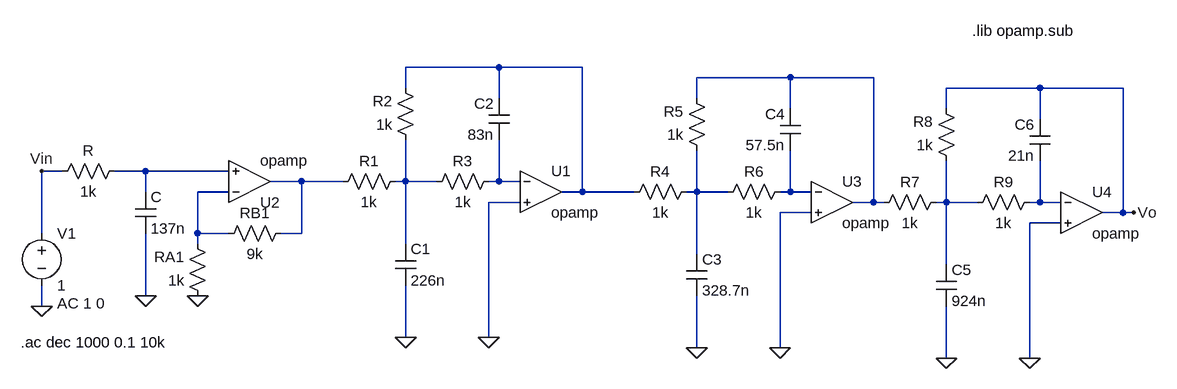
[diagram p0: schematic EJ3_4.asc]
EJ3_4.asc, the LTspice schematic file:
Version 4
SHEET 1 1168 680
WIRE 144 -64 0 -64
WIRE 272 -64 144 -64
WIRE 592 -48 448 -48
WIRE 720 -48 592 -48
WIRE 0 -32 0 -64
WIRE 976 -32 832 -32
WIRE 1104 -32 976 -32
WIRE 144 -16 144 -64
WIRE 448 -16 448 -48
WIRE 592 0 592 -48
WIRE 832 0 832 -32
WIRE 976 16 976 -32
WIRE -528 96 -560 96
WIRE -400 96 -448 96
WIRE -272 96 -400 96
WIRE -160 112 -208 112
WIRE -96 112 -160 112
WIRE 0 112 0 48
WIRE 0 112 -16 112
WIRE 48 112 0 112
WIRE 144 112 144 48
WIRE 144 112 128 112
WIRE 176 112 144 112
WIRE -400 128 -400 96
WIRE -272 128 -320 128
WIRE 272 128 272 -64
WIRE 272 128 240 128
WIRE 352 128 272 128
WIRE 448 128 448 64
WIRE 448 128 432 128
WIRE 496 128 448 128
WIRE 592 128 592 64
WIRE 592 128 576 128
WIRE 624 128 592 128
WIRE 176 144 128 144
WIRE 720 144 720 -48
WIRE 720 144 688 144
WIRE 736 144 720 144
WIRE 832 144 832 80
WIRE 832 144 816 144
WIRE 880 144 832 144
WIRE 976 144 976 80
WIRE 976 144 960 144
WIRE 1008 144 976 144
WIRE 624 160 576 160
WIRE 1104 160 1104 -32
WIRE 1104 160 1072 160
WIRE 1120 160 1104 160
WIRE 1008 176 960 176
WIRE -560 192 -560 96
WIRE -320 192 -320 128
WIRE -272 192 -320 192
WIRE -160 192 -160 112
WIRE -160 192 -192 192
WIRE -320 208 -320 192
WIRE 0 208 0 112
WIRE 448 224 448 128
WIRE 832 240 832 144
WIRE -400 288 -400 192
WIRE -560 304 -560 272
WIRE 0 352 0 272
WIRE 128 352 128 144
WIRE 448 368 448 288
WIRE 576 368 576 160
WIRE 832 384 832 304
WIRE 960 384 960 176
FLAG -560 304 0
FLAG -320 288 0
FLAG 0 352 0
FLAG 128 352 0
FLAG -560 96 Vin
FLAG -400 288 0
FLAG 448 368 0
FLAG 576 368 0
FLAG 832 384 0
FLAG 960 384 0
FLAG 1120 160 Vo
SYMBOL voltage -560 176 R0
WINDOW 123 24 124 Left 2
WINDOW 39 0 0 Left 0
SYMATTR Value2 AC 1 0
SYMATTR InstName V1
SYMATTR Value 1
SYMBOL OpAmps\\opamp 208 64 R0
SYMATTR InstName U1
SYMBOL OpAmps\\opamp -240 176 M180
SYMATTR InstName U2
SYMBOL res -432 80 R90
WINDOW 0 0 56 VBottom 2
WINDOW 3 32 56 VTop 2
SYMATTR InstName R
SYMATTR Value 1k
SYMBOL res 0 96 R90
WINDOW 0 0 56 VBottom 2
WINDOW 3 32 56 VTop 2
SYMATTR InstName R1
SYMATTR Value 1k
SYMBOL cap -16 208 R0
SYMATTR InstName C1
SYMATTR Value 226n
SYMBOL cap 160 48 R180
WINDOW 0 24 56 Left 2
WINDOW 3 24 8 Left 2
SYMATTR InstName C2
SYMATTR Value 83n
SYMBOL res 16 64 R180
WINDOW 0 36 76 Left 2
WINDOW 3 36 40 Left 2
SYMATTR InstName R2
SYMATTR Value 1k
SYMBOL res -304 304 R180
WINDOW 0 36 76 Left 2
WINDOW 3 36 40 Left 2
SYMATTR InstName RA1
SYMATTR Value 1k
SYMBOL res -288 208 R270
WINDOW 0 32 56 VTop 2
WINDOW 3 0 56 VBottom 2
SYMATTR InstName RB1
SYMATTR Value 9k
SYMBOL cap -416 128 R0
SYMATTR InstName C
SYMATTR Value 137n
SYMBOL res 144 96 R90
WINDOW 0 0 56 VBottom 2
WINDOW 3 32 56 VTop 2
SYMATTR InstName R3
SYMATTR Value 1k
SYMBOL OpAmps\\opamp 656 80 R0
SYMATTR InstName U3
SYMBOL res 448 112 R90
WINDOW 0 0 56 VBottom 2
WINDOW 3 32 56 VTop 2
SYMATTR InstName R4
SYMATTR Value 1k
SYMBOL cap 432 224 R0
SYMATTR InstName C3
SYMATTR Value 328.7n
SYMBOL cap 608 64 R180
WINDOW 0 24 56 Left 2
WINDOW 3 24 8 Left 2
SYMATTR InstName C4
SYMATTR Value 57.5n
SYMBOL res 464 80 R180
WINDOW 0 36 76 Left 2
WINDOW 3 36 40 Left 2
SYMATTR InstName R5
SYMATTR Value 1k
SYMBOL res 592 112 R90
WINDOW 0 0 56 VBottom 2
WINDOW 3 32 56 VTop 2
SYMATTR InstName R6
SYMATTR Value 1k
SYMBOL OpAmps\\opamp 1040 96 R0
SYMATTR InstName U4
SYMBOL res 832 128 R90
WINDOW 0 0 56 VBottom 2
WINDOW 3 32 56 VTop 2
SYMATTR InstName R7
SYMATTR Value 1k
SYMBOL cap 816 240 R0
SYMATTR InstName C5
SYMATTR Value 924n
SYMBOL cap 992 80 R180
WINDOW 0 24 56 Left 2
WINDOW 3 24 8 Left 2
SYMATTR InstName C6
SYMATTR Value 21n
SYMBOL res 848 96 R180
WINDOW 0 36 76 Left 2
WINDOW 3 36 40 Left 2
SYMATTR InstName R8
SYMATTR Value 1k
SYMBOL res 976 128 R90
WINDOW 0 0 56 VBottom 2
WINDOW 3 32 56 VTop 2
SYMATTR InstName R9
SYMATTR Value 1k
TEXT 872 -120 Left 2 !.lib opamp.sub
TEXT -592 360 Left 2 !.ac dec 1000 0.1 10k

The netlist it stands for:
* EJ3_4.asc
V1 Vin 0 1 AC 1 0
XU1 N006 0 N001 opamp Aol=100K GBW=10Meg  ; pins invin noninvin out
XU2 N007 N003 N004 opamp Aol=100K GBW=10Meg  ; pins invin noninvin out
R N003 Vin 1k
R1 N005 N004 1k
C1 N005 0 226n
C2 N006 N001 83n
R2 N005 N001 1k
RA1 0 N007 1k
RB1 N007 N004 9k
C N003 0 137n
R3 N006 N005 1k
XU3 N009 0 N002 opamp Aol=100K GBW=10Meg  ; pins invin noninvin out
R4 N008 N001 1k
C3 N008 0 328.7n
C4 N009 N002 57.5n
R5 N008 N002 1k
R6 N009 N008 1k
XU4 N011 0 Vo opamp Aol=100K GBW=10Meg  ; pins invin noninvin out
R7 N010 N002 1k
C5 N010 0 924n
C6 N011 Vo 21n
R8 N010 Vo 1k
R9 N011 N010 1k
.lib opamp.sub
.ac dec 1000 0.1 10k
.backanno
.end